# Altium schematic sheet ModuloWIFI.SchDoc
size A4; Engineer: Kayann Soares; SheetNumber: 3; SheetTotal: 11; CompanyInfo1: Universidade Federal do Ceará; CompanyInfo2: Centro de Tecnologia - CT; CompanyInfo3: Dep. de Eng. de Teleinformática
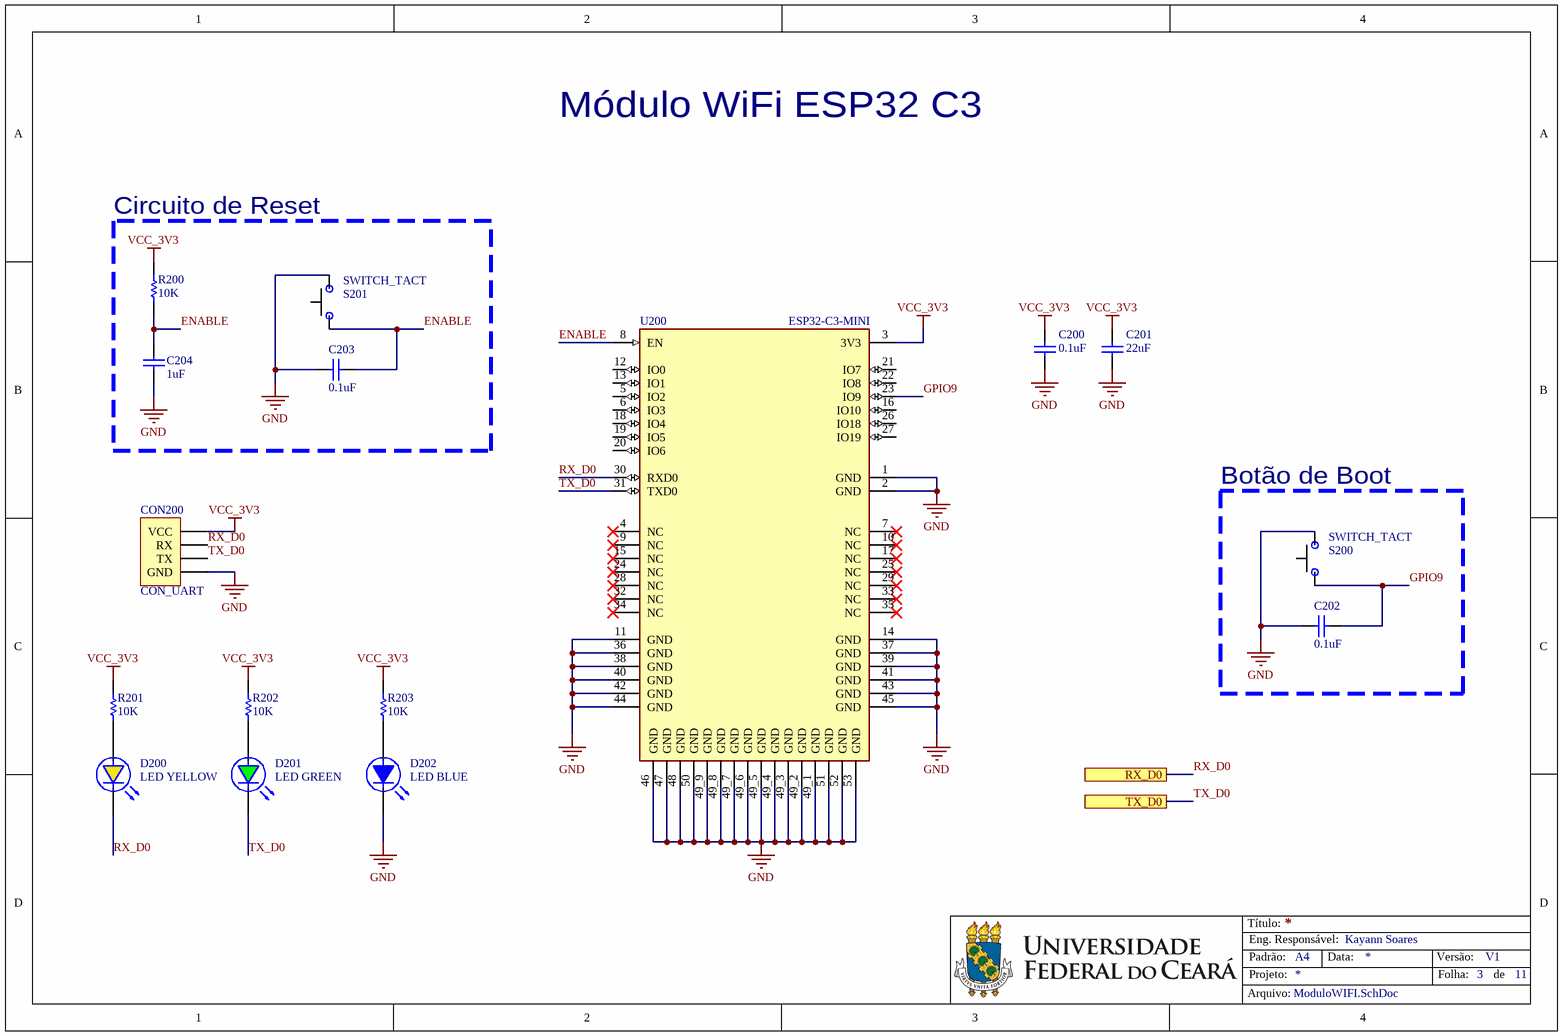
[diagram p0: ModuloWIFI.SchDoc]

## Parts
C200  0.1uF  [CAP_CER_0603]
C201  22uF  [CAP_CER_0603]
C202  0.1uF  [CAP_CER_0603]
C203  0.1uF  [CAP_CER_0603]
C204  1uF  [CAP_CER_0603]
CON200  CON_UART  [CON_UART]
D200  LED YELLOW  [LED_YELLOW_SMD_0603]
D201  LED GREEN  [LED_GREEN_SMD_0603]
D202  LED BLUE  [LED_BLUE_SMD_0603]
R200  10K  [RES_0603]
R201  10K  [RES_0603]
R202  10K  [RES_0603]
R203  10K  [RES_0603]
S200  SWITCH_TACT  [SWITCH_TACT_6.0x3.5]
S201  SWITCH_TACT  [SWITCH_TACT_6.0x3.5]
U200  ESP32-C3-MINI  [ESP32-C3-MINI]

## Blocks framed on the sheet
Botão de Boot: C202 S200

## Ports
RX_D0, TX_D0

## Nets
GND: C200.1 C201.1 C202.1 C203.1 C204.1 CON200.4(GND) D202.K S200.1 S201.1 U200.1(GND) U200.2(GND) U200.11(GND) U200.14(GND) U200.36(GND) U200.37(GND) U200.38(GND) U200.39(GND) U200.40(GND) U200.41(GND) U200.42(GND) U200.43(GND) U200.44(GND) U200.45(GND) U200.46(GND) U200.47(GND) U200.48(GND) U200.49_1(GND) U200.49_2(GND) U200.49_3(GND) U200.49_4(GND) U200.49_5(GND) U200.49_6(GND) U200.49_7(GND) U200.49_8(GND) U200.49_9(GND) U200.50(GND) U200.51(GND) U200.52(GND) U200.53(GND)
VCC_3V3: C200.2 C201.2 CON200.1(VCC) R200.2 R201.2 R202.2 R203.2 U200.3(3V3)
ENABLE: C203.2 C204.2 R200.1 S201.2 U200.8(EN)
GPIO9: C202.2 S200.2 U200.23(IO9)
RX_D0: CON200.2(RX) D200.K U200.30(RXD0) ; port RX_D0
TX_D0: CON200.3(TX) D201.K U200.31(TXD0) ; port TX_D0
NetD200_A: D200.A R201.1
NetD201_A: D201.A R202.1
NetD202_A: D202.A R203.1

Not connected (* = marked no-connect by the designer): U200 4(NC)* 5(IO2) 6(IO3) 7(NC)* 9(NC)* 10(NC)* 12(IO0) 13(IO1) 15(NC)* 16(IO10) 17(NC)* 18(IO4) 19(IO5) 20(IO6) 21(IO7) 22(IO8) 24(NC)* 25(NC)* 26(IO18) 27(IO19) 28(NC)* 29(NC)* 32(NC)* 33(NC)* 34(NC)* 35(NC)*

## Notes on the sheet
- Módulo WiFi ESP32 C3
- Circuito de Reset
- Título:
- Padrão:
- Projeto:
- Eng. Responsável:
- A4
- Data:
- Versão:
- Folha:
- V1
- de
- Arquivo:

## Library data of the parts
C200 C202 C203 = CAP_CER_0.1uF_0603: Supplier 1: Digi-Key Marketplace; Supplier Part Number 1: 2571-GMC10X7R104J25NTTR-ND
C201 = CAP_CER_22uF_0603: Supplier 1: Newark; Supplier Part Number 1: 03AC2653
C204 = CAP_CER_1uF_0603: Supplier 1: Arrow Electronics; Supplier Part Number 1: CL10B105KP8NNNC
D200 = LED_YELLOW_SMD_0603: Supplier 1: Digi-Key; Supplier Part Number 1: 754-1124-1-ND
D201 = LED_GREEN_SMD_0603: Supplier 1: Digi-Key; Supplier Part Number 1: 754-1121-1-ND
D202 = LED_BLUE_SMD_0603: ComponentLink1Description: New link; ComponentLink1URL: *; Supplier 1: Digi-Key; Supplier Part Number 1: 754-1434-1-ND
R200-R203 = RES_10K_0603: Supplier 1: Digi-Key Marketplace; Supplier Part Number 1: 2571-RM06J103CTTR-ND
S200 S201 = SWITCH_TACT_6.0x3.5: Supplier 1: Newark; Supplier Part Number 1: 35AH5169
U200 = ESP32-C3-MINI: Supplier 1: Mouser; Supplier Part Number 1: 356-ESP32-C3-MINI1H4